# EAGLE schematic citizen_science_flora_v2_DFA_corrected (EAGLE 9.6.2)

## Sheet 1 of 4
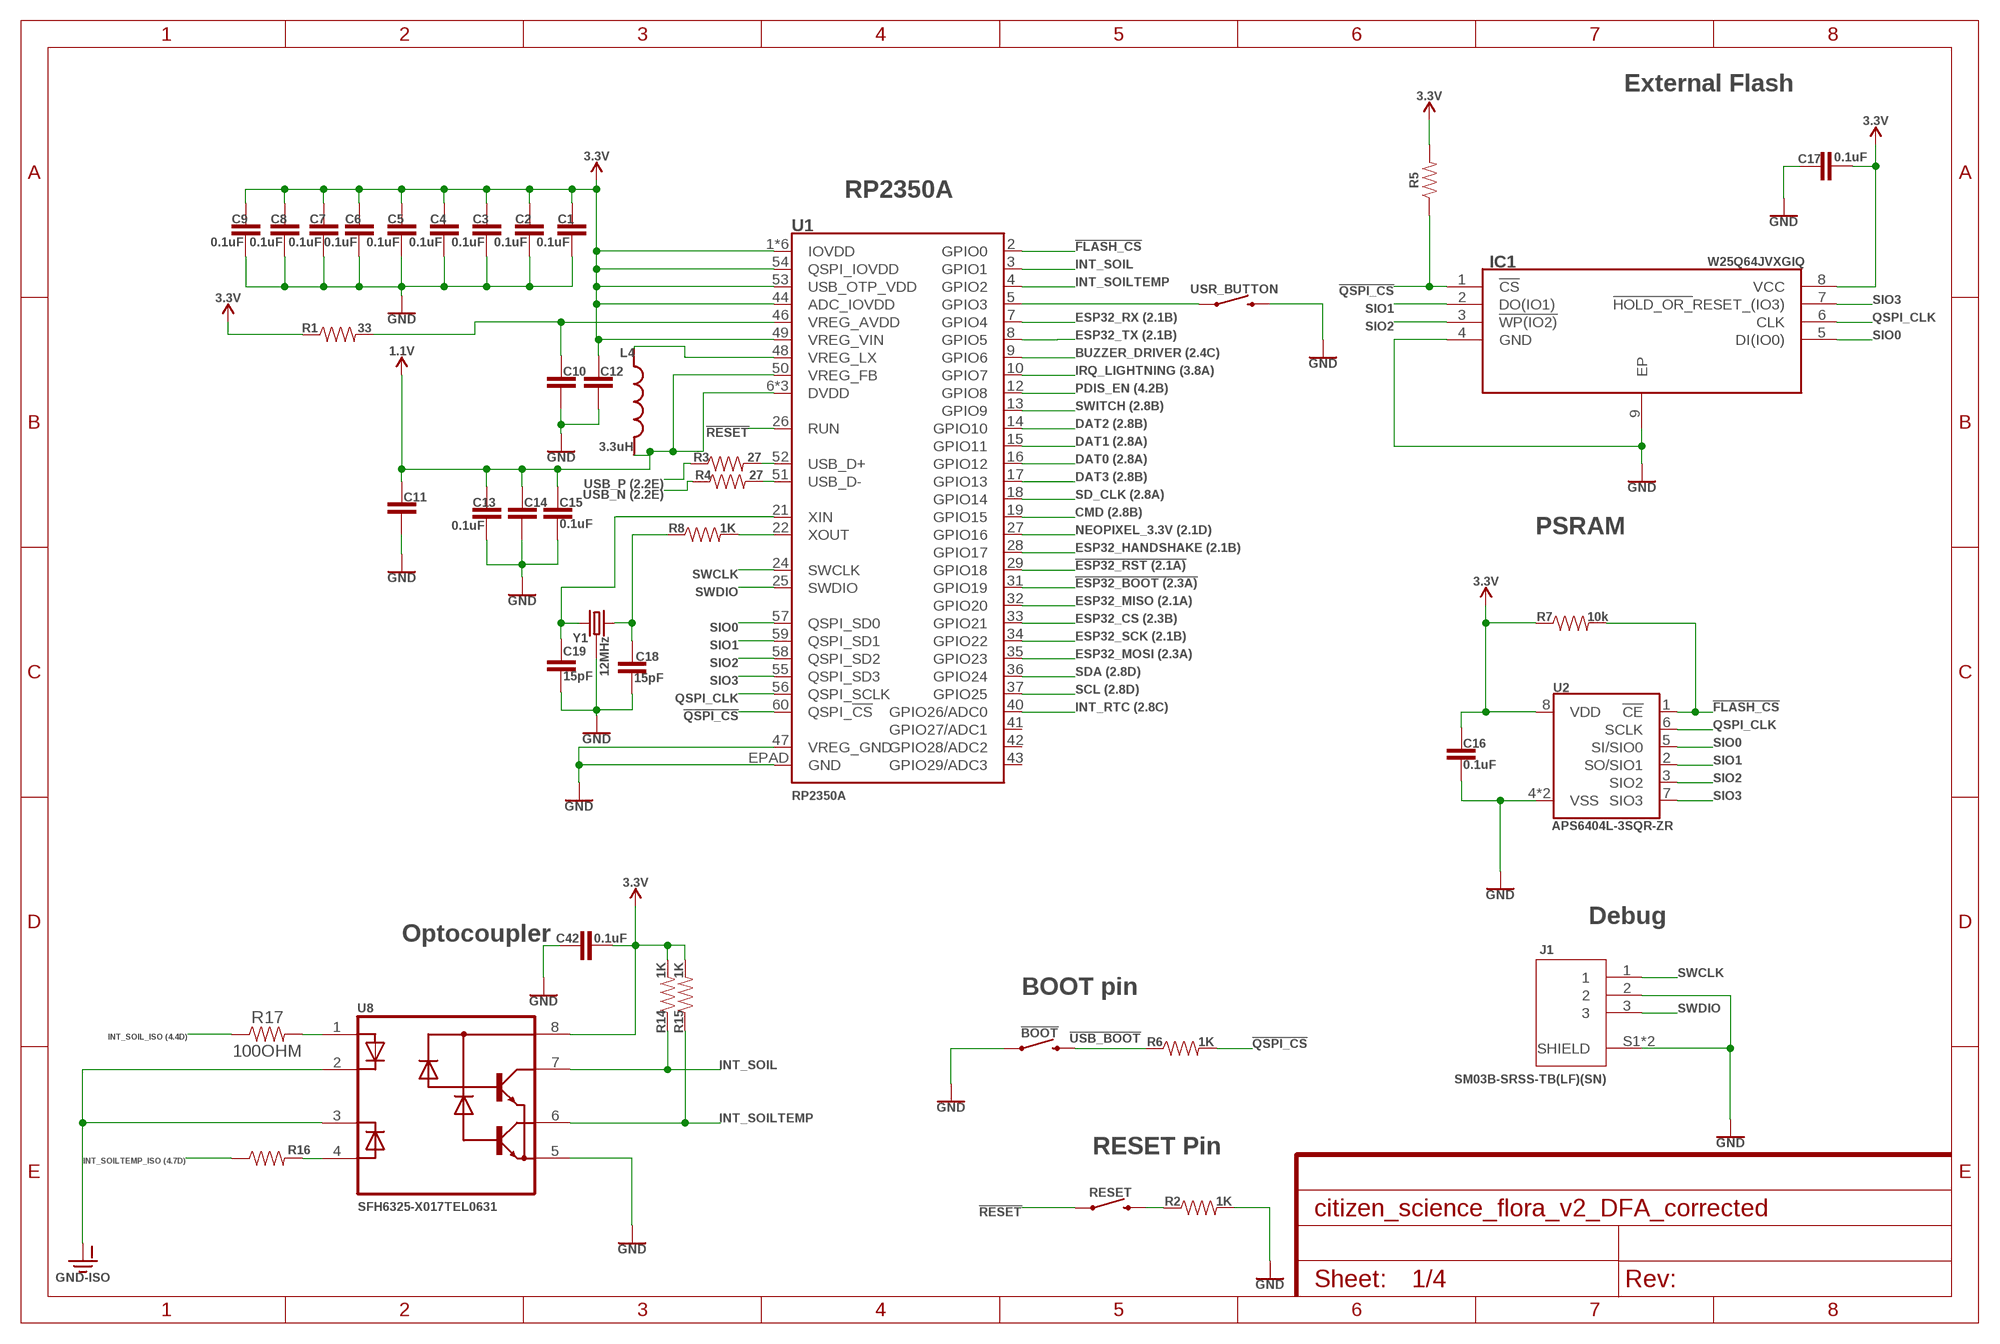
[diagram p0: schematic, sheet 1]

### Parts
!BOOT  MOMENTARY-SWITCH-SPST-SMD-4.6X2.8MM  [TACTILE_SWITCH_SMD_4.6X2.8MM]
C1  0.1uF  0.1UF-0402-6.3V-10%-X7R  [0402]
C2  0.1uF  0.1UF-0402-6.3V-10%-X7R  [0402]
C3  0.1uF  0.1UF-0402-6.3V-10%-X7R  [0402]
C4  0.1uF  0.1UF-0402-6.3V-10%-X7R  [0402]
C5  0.1uF  0.1UF-0402-6.3V-10%-X7R  [0402]
C6  0.1uF  0.1UF-0402-6.3V-10%-X7R  [0402]
C7  0.1uF  0.1UF-0402-6.3V-10%-X7R  [0402]
C8  0.1uF  0.1UF-0402-6.3V-10%-X7R  [0402]
C9  0.1uF  0.1UF-0402-6.3V-10%-X7R  [0402]
C10  4.7UF0402  [0402]
C11  4.7UF0402  [0402]
C12  4.7UF0402  [0402]
C13  0.1uF  0.1UF-0402-6.3V-10%-X7R  [0402]
C14  4.7UF0402  [0402]
C15  0.1uF  0.1UF-0402-6.3V-10%-X7R  [0402]
C16  0.1uF  0.1UF-0402-6.3V-10%-X7R  [0402]
C17  0.1uF  0.1UF-0402-6.3V-10%-X7R  [0402]
C18  15pF  15PF-0402-50V-5%  [0402]
C19  15pF  15PF-0402-50V-5%  [0402]
C42  0.1uF  0.1UF-0402-6.3V-10%-X7R  [0402]
IC1  W25Q64JVXGIQ  [SON80P400X400X50-9N]
J1  SM03B-SRSS-TB(LF)(SN)  [JST_SM03B-SRSS-TB(LF)(SN)]
L4  3.3uH  LQH2MCN120K02L  [IND_LQH2MCN120K02L]
R1  33  33OHM-0402-1/10W-1%  [0402]
R2  1K  1KOHM-0402-1/16W-1%  [0402]
R3  27  27OHM0402  [0402]
R4  27  27OHM0402  [0402]
R5  RESISTOR0402  [0402]
R6  1K  1KOHM-0402-1/16W-1%  [0402]
R7  10k  10KOHM-0402-1/16W-1%  [0402]
R8  1K  1KOHM-0402-1/16W-1%  [0402]
R14  1K  1KOHM-0402-1/16W-1%  [0402]
R15  1K  1KOHM-0402-1/16W-1%  [0402]
R16  100OHM  [0402]
R17  100OHM  [0402]
RESET  MOMENTARY-SWITCH-SPST-SMD-4.6X2.8MM  [TACTILE_SWITCH_SMD_4.6X2.8MM]
U1  RP2350A  [RP2350A]
U2  APS6404L-3SQR-ZR  [APS6404L-3SQR-ZR]
U8  SFH6325-X017TEL0631  [SOIC127P599X175-8N]
USR_BUTTON  MOMENTARY-SWITCH-SPST-SMD-4.6X2.8MM  [TACTILE_SWITCH_SMD_4.6X2.8MM]
Y1  12MHz  CRYSTAL-GROUNDEDSMD-3.2X2.5  [CRYSTAL-SMD-3.2X2.5MM]

### Nets
1.1V: C11.1 C13.1 C14.1 C15.1 L4.2 U1.6(DVDD) U1.23(DVDD) U1.39(DVDD) U1.50(VREG_FB)
3.3V: C1.1 C2.1 C3.1 C4.1 C5.1 C6.1 C7.1 C8.1 C9.1 C12.1 C16.1 C17.2 C42.2 IC1.8(VCC) R1.1 R5.2 R7.1 R14.2 R15.2 U1.1(IOVDD) U1.11(IOVDD) U1.20(IOVDD) U1.30(IOVDD) U1.38(IOVDD) U1.44(ADC_IOVDD) U1.45(IOVDD) U1.49(VREG_VIN) U1.53(USB_OTP_VDD) U1.54(QSPI_IOVDD) U2.8(VDD) U8.8(C(VCC)) ; also sheet 2,3,4
!ESP32_BOOT: U1.31(GPIO19) ; also sheet 2
!ESP32_RST: U1.29(GPIO18) ; also sheet 2
!FLASH_CS: R7.2 U1.2(GPIO0) U2.1(!CE!)
!QSPI_CS: IC1.1(!CS) R5.1 R6.2 U1.60(QSPI_!CS!)
!RESET: RESET.1 RESET.2 U1.26(RUN)
!USB_BOOT: !BOOT.3 !BOOT.4 R6.1
BUZZER_DRIVER: U1.9(GPIO6) ; also sheet 2
CMD: U1.19(GPIO15) ; also sheet 2
DAT0: U1.16(GPIO12) ; also sheet 2
DAT1: U1.15(GPIO11) ; also sheet 2
DAT2: U1.14(GPIO10) ; also sheet 2
DAT3: U1.17(GPIO13) ; also sheet 2
ESP32_CS: U1.33(GPIO21) ; also sheet 2
ESP32_HANDSHAKE: U1.28(GPIO17) ; also sheet 2
ESP32_MISO: U1.32(GPIO20) ; also sheet 2
ESP32_MOSI: U1.35(GPIO23) ; also sheet 2
ESP32_RX: U1.7(GPIO4) ; also sheet 2
ESP32_SCK: U1.34(GPIO22) ; also sheet 2
ESP32_TX: U1.8(GPIO5) ; also sheet 2
GND: !BOOT.1 !BOOT.2 C1.2 C2.2 C3.2 C4.2 C5.2 C6.2 C7.2 C8.2 C9.2 C10.2 C11.2 C12.2 C13.2 C14.2 C15.2 C16.2 C17.1 C18.2 C19.2 C42.1 IC1.4(GND) IC1.9(EP) J1.2 J1.S1(SHIELD) J1.S2(SHIELD) R2.2 U1.47(VREG_GND) U1.EPAD(GND) U2.4(VSS) U2.9(VSS) U8.5(E(GND)) USR_BUTTON.3 USR_BUTTON.4 Y1.2(GND) Y1.4(GND) ; also sheet 2,3,4
GND-ISO: U8.2(C1) U8.3(C2) ; also sheet 4
INT_RTC: U1.40(GPIO26/ADC0) ; also sheet 2
INT_SOIL: R14.1 U1.3(GPIO1) U8.7(C1(VO1))
INT_SOIL_ISO: R17.1 ; also sheet 4
INT_SOILTEMP: R15.1 U1.4(GPIO2) U8.6(C2(VO2))
INT_SOILTEMP_ISO: R16.1 ; also sheet 4
IRQ_LIGHTNING: U1.10(GPIO7) ; also sheet 3
N$1: C10.1 R1.2 U1.46(VREG_AVDD)
N$2: L4.1 U1.48(VREG_LX)
N$3: R2.1 RESET.3 RESET.4
N$4: C18.1 R8.1 Y1.3
N$7: C19.1 U1.21(XIN) Y1.1
N$8: R8.2 U1.22(XOUT)
N$13: R16.2 U8.4(A2)
N$14: R17.2 U8.1(A1)
N$25: U1.5(GPIO3) USR_BUTTON.1 USR_BUTTON.2
NEOPIXEL_3.3V: U1.27(GPIO16) ; also sheet 2
PDIS_EN: U1.12(GPIO8) ; also sheet 4
QSPI_CLK: IC1.6(CLK) U1.56(QSPI_SCLK) U2.6(SCLK)
SCL: U1.37(GPIO25) ; also sheet 2,3,4
SD_CLK: U1.18(GPIO14) ; also sheet 2
SDA: U1.36(GPIO24) ; also sheet 2,3,4
SIO0: IC1.5(DI(IO0)) U1.57(QSPI_SD0) U2.5(SI/SIO0)
SIO1: IC1.2(DO(IO1)) U1.59(QSPI_SD1) U2.2(SO/SIO1)
SIO2: IC1.3(!WP(IO2)) U1.58(QSPI_SD2) U2.3(SIO2)
SIO3: IC1.7(!HOLD_OR_!RESET_(IO3)) U1.55(QSPI_SD3) U2.7(SIO3)
SWCLK: J1.1 U1.24(SWCLK)
SWDIO: J1.3 U1.25(SWDIO)
SWITCH: U1.13(GPIO9) ; also sheet 2
USB_N: R4.1 ; also sheet 2
USB_P: R3.1 ; also sheet 2
USBD_N: R4.2 U1.51(USB_D-)
USBD_P: R3.2 U1.52(USB_D+)
Unconnected: U1.41(GPIO27/ADC1) U1.42(GPIO28/ADC2) U1.43(GPIO29/ADC3)

### Notes on the sheet
- External Flash
- RP2350A
- PSRAM
- Debug
- Optocoupler
- BOOT pin
- RESET Pin

## Sheet 2 of 4
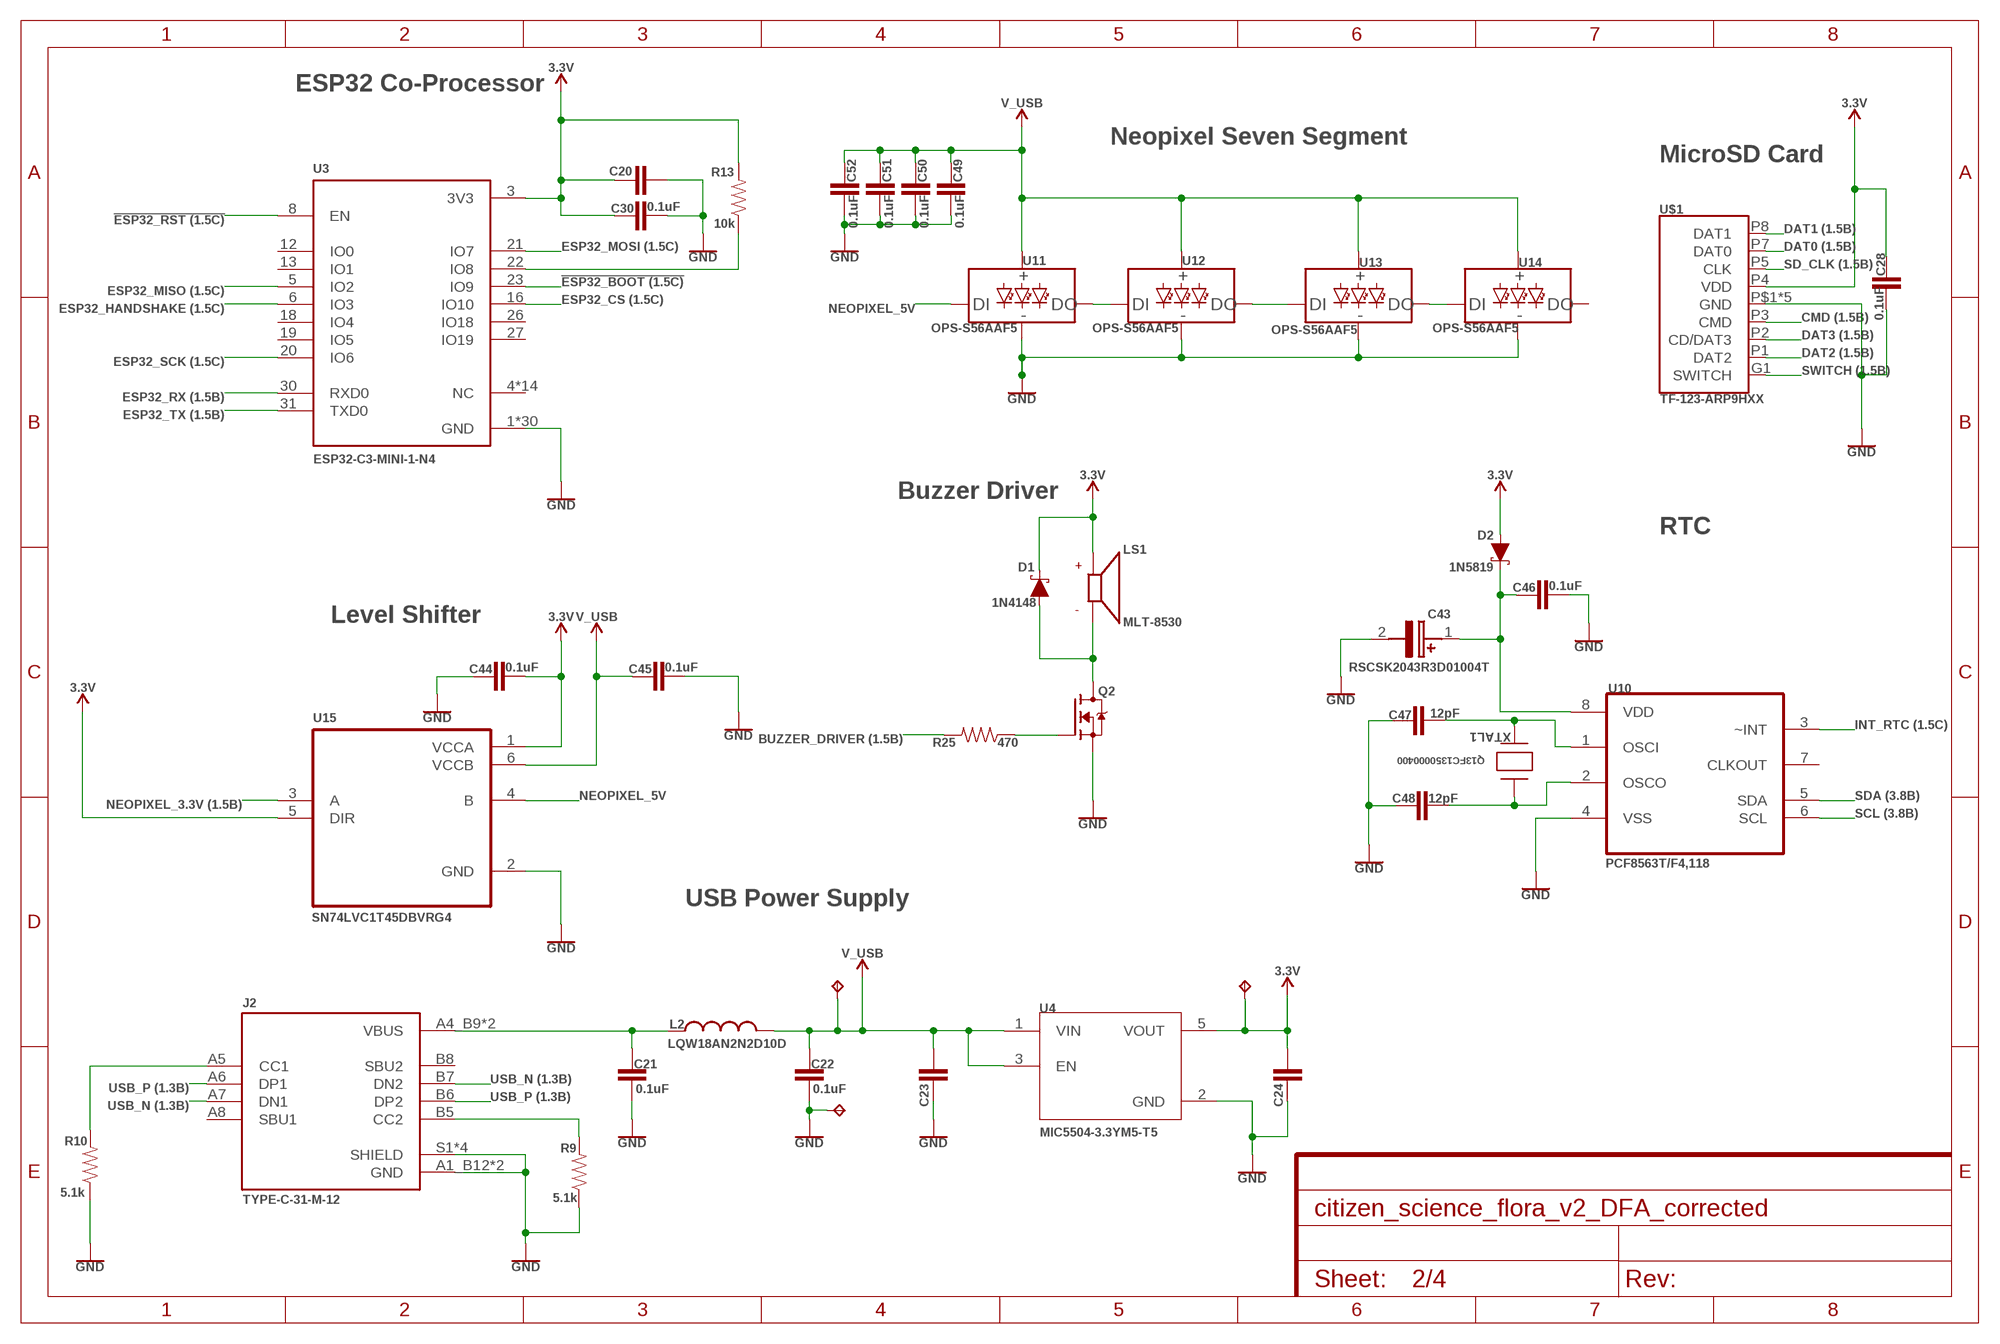
[diagram p1: schematic, sheet 2]

### Parts
3.3V  TPB1,27  [B1,27]
C20  10UF0402  [0402]
C21  0.1uF  0.1UF-0402-6.3V-10%-X7R  [0402]
C22  0.1uF  0.1UF-0402-6.3V-10%-X7R  [0402]
C23  10UF0402  [0402]
C24  10UF0402  [0402]
C28  0.1uF  0.1UF-0402-6.3V-10%-X7R  [0402]
C30  0.1uF  0.1UF-0402-6.3V-10%-X7R  [0402]
C43  RSCSK2043R3D01004T  [RSCSK2043R3D01004T]
C44  0.1uF  0.1UF-0402-6.3V-10%-X7R  [0402]
C45  0.1uF  0.1UF-0402-6.3V-10%-X7R  [0402]
C46  0.1uF  0.1UF-0402-6.3V-10%-X7R  [0402]
C47  12pF  12PF-0402-50V-5%  [0402]
C48  12pF  12PF-0402-50V-5%  [0402]
C49  0.1uF  0.1UF-0402-6.3V-10%-X7R  [0402]
C50  0.1uF  0.1UF-0402-6.3V-10%-X7R  [0402]
C51  0.1uF  0.1UF-0402-6.3V-10%-X7R  [0402]
C52  0.1uF  0.1UF-0402-6.3V-10%-X7R  [0402]
D1  1N4148  DIODE-SCHOTTKY-BAT60A  [SOD-323]
D2  1N5819  DIODE-SCHOTTKY-BAT20J  [SOD-323]
GND  TPB1,27  [B1,27]
J2  TYPE-C-31-M-12  [HRO_TYPE-C-31-M-12]
L2  LQW18AN2N2D10D  [INDC1608X100N]
LS1  MLT-8530  CMT-8504-100-SMT-TR  [XDCR_CMT-8504-100-SMT-TR]
Q2  BSS138  [SOT95P240X111-3N]
R9  5.1k  5.1KOHM-0402-1/16W-1%  [0402]
R10  5.1k  5.1KOHM-0402-1/16W-1%  [0402]
R13  10k  10KOHM-0402-1/16W-1%  [0402]
R25  470  10KOHM-0402-1/16W-1%  [0402]
U3  ESP32-C3-MINI-1-N4  [XCVR_ESP32-C3-MINI-1-N4]
U4  MIC5504-3.3YM5-T5  [SOT95P280X145-5N]
U10  PCF8563T/F4,118  [SOIC127P600X175-8N]
U11  OPS-S56AAF5  [OPS-S56AAF5]
U12  OPS-S56AAF5  [OPS-S56AAF5]
U13  OPS-S56AAF5  [OPS-S56AAF5]
U14  OPS-S56AAF5  [OPS-S56AAF5]
U15  SN74LVC1T45DBVRG4  [SOT95P280X145-6N]
U$1  TF-123-ARP9HXX  [MICROSDCARD]
USB  V_USB  TPB1,27  [B1,27]
XTAL1  Q13FC1350000400  [XTAL_FC-135_EPS]

### Nets
3.3V: 3.3V.TP C20.1 C24.2 C28.1 C30.1 C44.2 D1.C D2.A LS1.P R13.2 U3.3(3V3) U4.5(VOUT) U15.1(VCCA) U15.5(DIR) U$1.P4(VDD) ; also sheet 1,3,4
!ESP32_BOOT: U3.23(IO9) ; also sheet 1
!ESP32_RST: U3.8(EN) ; also sheet 1
BUZZER_DRIVER: R25.2 ; also sheet 1
CMD: U$1.P3(CMD) ; also sheet 1
DAT0: U$1.P7(DAT0) ; also sheet 1
DAT1: U$1.P8(DAT1) ; also sheet 1
DAT2: U$1.P1(DAT2) ; also sheet 1
DAT3: U$1.P2(CD/DAT3) ; also sheet 1
ESP32_CS: U3.16(IO10) ; also sheet 1
ESP32_HANDSHAKE: U3.6(IO3) ; also sheet 1
ESP32_MISO: U3.5(IO2) ; also sheet 1
ESP32_MOSI: U3.21(IO7) ; also sheet 1
ESP32_RX: U3.30(RXD0) ; also sheet 1
ESP32_SCK: U3.20(IO6) ; also sheet 1
ESP32_TX: U3.31(TXD0) ; also sheet 1
GND: C20.2 C21.2 C22.2 C23.1 C24.1 C28.2 C30.2 C43.2(-) C44.1 C45.2 C46.2 C47.1 C48.1 C49.2 C50.2 C51.2 C52.2 GND.TP J2.A1_B12(GND) J2.B1_A12(GND) J2.S1(SHIELD) J2.S2(SHIELD) J2.S3(SHIELD) J2.S4(SHIELD) Q2.2(S) R9.1 R10.1 U3.1(GND) U3.2(GND) U3.11(GND) U3.14(GND) U3.36(GND) U3.37(GND) U3.38(GND) U3.39(GND) U3.40(GND) U3.41(GND) U3.42(GND) U3.43(GND) U3.44(GND) U3.45(GND) U3.46(GND) U3.47(GND) U3.48(GND) U3.49_1(GND) U3.49_2(GND) U3.49_3(GND) U3.49_4(GND) U3.49_5(GND) U3.49_6(GND) U3.49_7(GND) U3.49_8(GND) U3.49_9(GND) U3.50(GND) U3.51(GND) U3.52(GND) U3.53(GND) U4.2(GND) U10.4(VSS) U11.P$3(GND) U12.P$3(GND) U13.P$3(GND) U14.P$3(GND) U15.2(GND) U$1.P6(GND) U$1.P$1(GND) U$1.P$2(GND) U$1.P$3(GND) U$1.P$4(GND) ; also sheet 1,3,4
INT_RTC: U10.3(~INT) ; also sheet 1
N$9: J2.A5(CC1) R10.2
N$10: J2.B5(CC2) R9.2
N$11: C21.1 J2.A4_B9(VBUS) J2.B4_A9(VBUS) L2.1
N$12: R13.1 U3.22(IO8)
N$22: U11.P$2(DO) U12.P$4(DI)
N$23: U12.P$2(DO) U13.P$4(DI)
N$24: U13.P$2(DO) U14.P$4(DI)
N$26: D1.A LS1.N Q2.3(D)
N$27: Q2.1(G) R25.1
N$28: C43.1(+) C46.1 D2.C U10.8(VDD)
N$29: C48.2 U10.2(OSCO) XTAL1.1
N$30: C47.2 U10.1(OSCI) XTAL1.2
NEOPIXEL_3.3V: U15.3(A) ; also sheet 1
NEOPIXEL_5V: U11.P$4(DI) U15.4(B)
SCL: U10.6(SCL) ; also sheet 1,3,4
SD_CLK: U$1.P5(CLK) ; also sheet 1
SDA: U10.5(SDA) ; also sheet 1,3,4
SWITCH: U$1.G1(SWITCH) ; also sheet 1
USB_N: J2.A7(DN1) J2.B7(DN2) ; also sheet 1
USB_P: J2.A6(DP1) J2.B6(DP2) ; also sheet 1
V_USB: C22.1 C23.2 C45.1 C49.1 C50.1 C51.1 C52.1 L2.2 U4.1(VIN) U4.3(EN) U11.P$1(VCC) U12.P$1(VCC) U13.P$1(VCC) U14.P$1(VCC) U15.6(VCCB) USB.TP ; also sheet 4
Unconnected: J2.A8(SBU1) J2.B8(SBU2) U3.4(NC) U3.7(NC) U3.9(NC) U3.10(NC) U3.12(IO0) U3.13(IO1) U3.15(NC) U3.17(NC) U3.18(IO4) U3.19(IO5) U3.24(NC) U3.25(NC) U3.26(IO18) U3.27(IO19) U3.28(NC) U3.29(NC) U3.32(NC) U3.33(NC) U3.34(NC) U3.35(NC) U10.7(CLKOUT) U14.P$2(DO)

### Notes on the sheet
- ESP32 Co-Processor
- Neopixel Seven Segment
- MicroSD Card
- Buzzer Driver
- RTC
- Level Shifter
- USB Power Supply

## Sheet 3 of 4
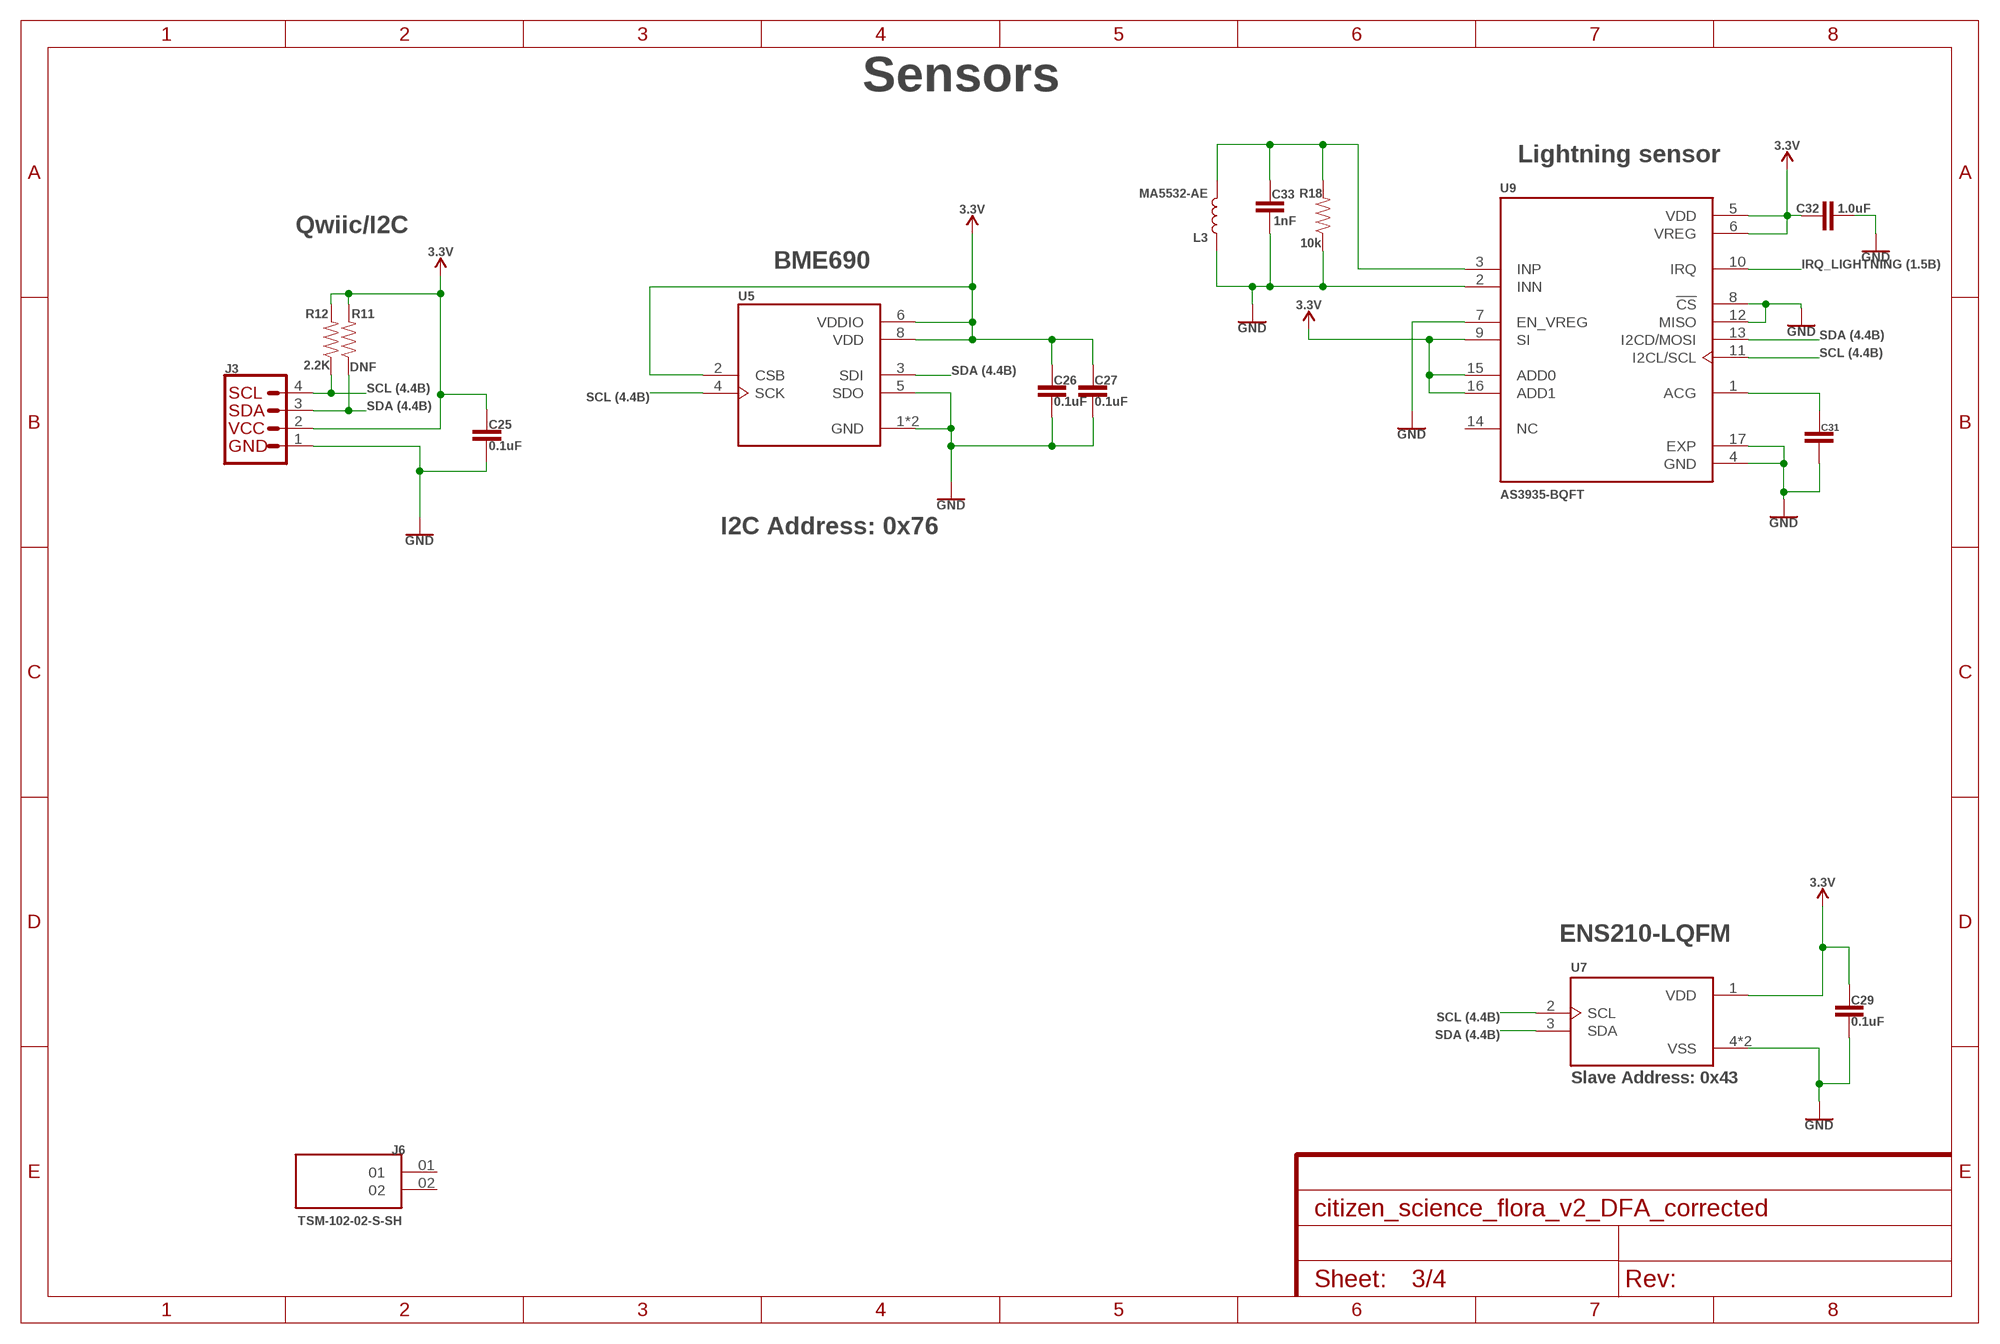
[diagram p2: schematic, sheet 3]

### Parts
C25  0.1uF  0.1UF-0402-6.3V-10%-X7R  [0402]
C26  0.1uF  0.1UF-0402-6.3V-10%-X7R  [0402]
C27  0.1uF  0.1UF-0402-6.3V-10%-X7R  [0402]
C29  0.1uF  0.1UF-0402-6.3V-10%-X7R  [0402]
C31  10UF0402  [0402]
C32  1.0uF  1.0UF-0402-16V-10%  [0402]
C33  1nF  1.0NF/1000PF-0402-25V-10%-X7R  [0402]
J3  QWIIC_CONNECTORJS-1MM  [1X04_1MM_RA]
J6  TSM-102-02-S-SH  [SAMTEC_TSM-102-02-S-SH]
L3  MA5532-AE  [MA5532-AE]
R11  DNF  2.2KOHM-0402-1/16W-1%  [0402]
R12  2.2K  2.2KOHM-0402-1/16W-1%  [0402]
R18  10k  10KOHM-0402-1/16W-1%  [0402]
U5  BME690  [IC_BME688]
U7  ENS210-LQFM  [XDCR_ENS210-LQFM]
U9  AS3935-BQFT  [QFN65P400X400X80-17N]

### Nets
3.3V: C25.1 C26.1 C27.1 C29.1 C32.1 J3.2 R11.2 R12.2 U5.2(CSB) U5.6(VDDIO) U5.8(VDD) U7.1(VDD) U9.5(VDD) U9.6(VREG) U9.9(SI) U9.15(ADD0) U9.16(ADD1) ; also sheet 1,2,4
GND: C25.2 C26.2 C27.2 C29.2 C31.2 C32.2 C33.2 J3.1 L3.1 R18.1 U5.1(GND) U5.5(SDO) U5.7(GND) U7.4(VSS) U7.5(VSS) U9.2(INN) U9.4(GND) U9.7(EN_VREG) U9.8(!CS) U9.12(MISO) U9.17(EXP) ; also sheet 1,2,4
IRQ_LIGHTNING: U9.10(IRQ) ; also sheet 1
N$15: C31.1 U9.1(ACG)
N$16: C33.1 L3.2 R18.2 U9.3(INP)
SCL: J3.4 R12.1 U5.4(SCK) U7.2(SCL) U9.11(I2CL/SCL) ; also sheet 1,2,4
SDA: J3.3 R11.1 U5.3(SDI) U7.3(SDA) U9.13(I2CD/MOSI) ; also sheet 1,2,4
Unconnected: J6.01 J6.02 U9.14(NC)

### Notes on the sheet
- Sensors
- Lightning sensor
- Qwiic/I2C
- I2C Address: 0x76
- Slave Address: 0x43

## Sheet 4 of 4
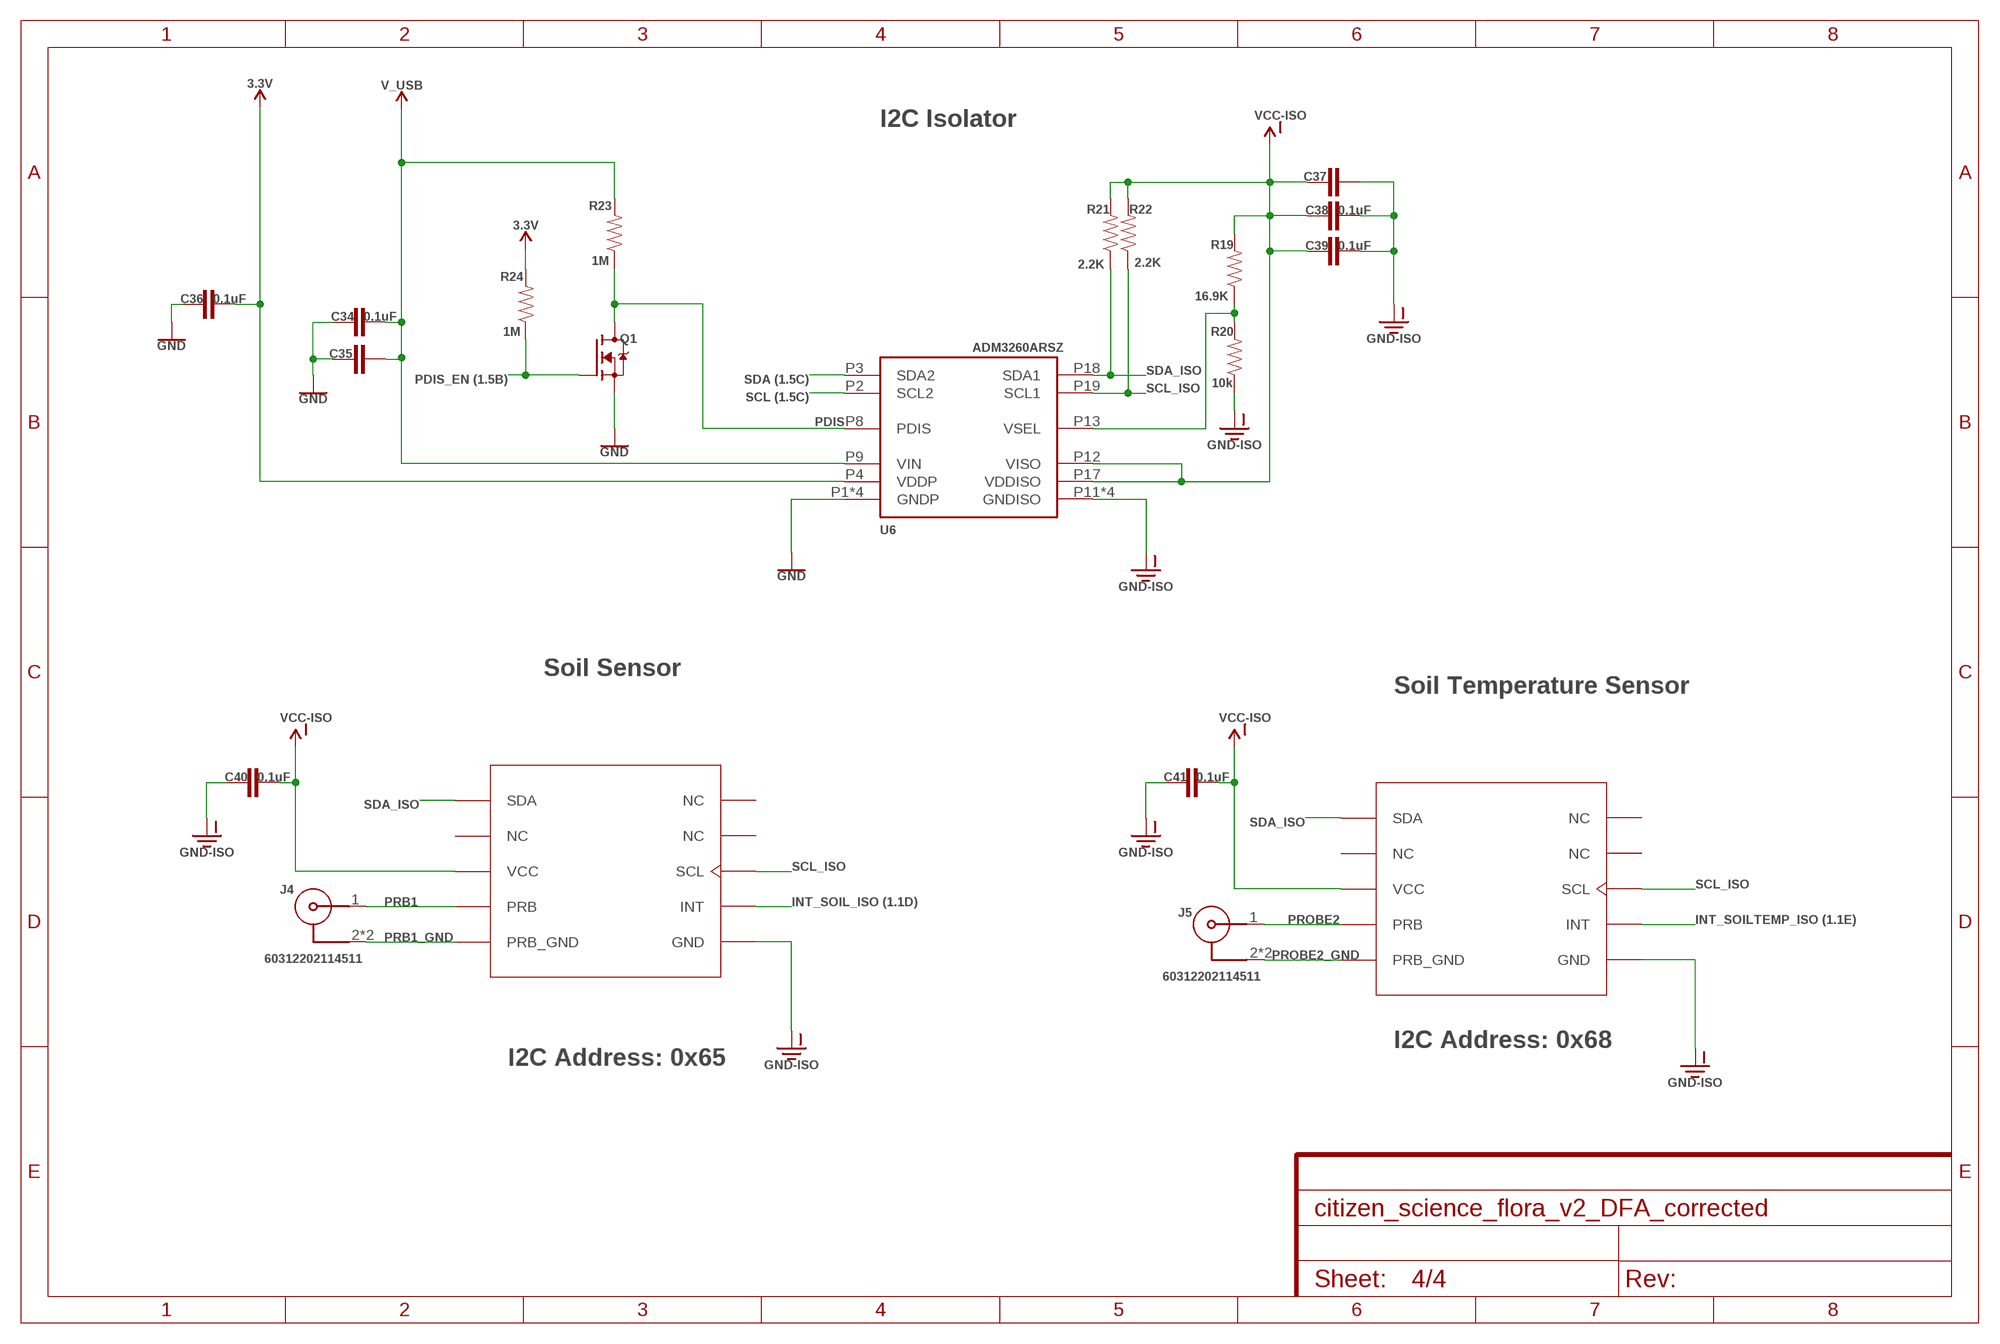
[diagram p3: schematic, sheet 4]

### Parts
C34  0.1uF  0.1UF-0402-6.3V-10%-X7R  [0402]
C35  10UF0402  [0402]
C36  0.1uF  0.1UF-0402-6.3V-10%-X7R  [0402]
C37  10UF0402  [0402]
C38  0.1uF  0.1UF-0402-6.3V-10%-X7R  [0402]
C39  0.1uF  0.1UF-0402-6.3V-10%-X7R  [0402]
C40  0.1uF  0.1UF-0402-6.3V-10%-X7R  [0402]
C41  0.1uF  0.1UF-0402-6.3V-10%-X7R  [0402]
J4  60312202114511  [60312202114511]
J5  60312202114511  [60312202114511]
Q1  BSS138  [SOT95P240X111-3N]
R19  16.9K  RESISTOR0402  [0402]
R20  10k  10KOHM-0402-1/16W-1%  [0402]
R21  2.2K  2.2KOHM-0402-1/16W-1%  [0402]
R22  2.2K  2.2KOHM-0402-1/16W-1%  [0402]
R23  1M  1MOHM-0402-1/16W-5%  [0402]
R24  1M  1MOHM-0402-1/16W-5%  [0402]
U6  ADM3260ARSZ  [SSOP20]
U$2  PH-OEM  [PH_SENSOR]
U$3  PH-OEM  [PH_SENSOR]

### Nets
3.3V: C36.2 R24.2 U6.P4(VDDP) ; also sheet 1,2,3
GND: C34.1 C35.1 C36.1 Q1.2(S) U6.P1(GNDP) U6.P5(GNDP) U6.P7(GNDP) U6.P10(GNDP) ; also sheet 1,2,3
GND-ISO: C37.2 C38.2 C39.2 C40.1 C41.1 R20.1 U6.P11(GNDISO) U6.P14(GNDISO) U6.P16(GNDISO) U6.P20(GNDISO) U$2.P$6(GND) U$3.P$6(GND) ; also sheet 1
INT_SOIL_ISO: U$2.P$7(INT) ; also sheet 1
INT_SOILTEMP_ISO: U$3.P$7(INT) ; also sheet 1
N$17: R19.1 R20.2 U6.P13(VSEL)
PDIS: Q1.3(D) R23.1 U6.P8(PDIS)
PDIS_EN: Q1.1(G) R24.1 ; also sheet 1
PRB1: J4.1 U$2.P$4(PRB)
PRB1_GND: J4.2 J4.3 U$2.P$5(PRB_GND)
PROBE2: J5.1 U$3.P$4(PRB)
PROBE2_GND: J5.2 J5.3 U$3.P$5(PRB_GND)
SCL: U6.P2(SCL2) ; also sheet 1,2,3
SCL_ISO: R22.1 U6.P19(SCL1) U$2.P$8(SCL) U$3.P$8(SCL)
SDA: U6.P3(SDA2) ; also sheet 1,2,3
SDA_ISO: R21.1 U6.P18(SDA1) U$2.P$1(SDA) U$3.P$1(SDA)
V_USB: C34.2 C35.2 R23.2 U6.P9(VIN) ; also sheet 2
VCC-ISO: C37.1 C38.1 C39.1 C40.2 C41.2 R19.2 R21.2 R22.2 U6.P12(VISO) U6.P17(VDDISO) U$2.P$3(VCC) U$3.P$3(VCC)
Unconnected: U$2.P$2(NC) U$2.P$9(NC) U$2.P$10(NC) U$3.P$2(NC) U$3.P$9(NC) U$3.P$10(NC)

### Notes on the sheet
- I2C Isolator
- Soil Sensor
- Soil Temperature Sensor
- I2C Address: 0x68
- I2C Address: 0x65

## Library data of the parts
3.3V GND USB = testpad:TP: Test pad
!BOOT RESET USR_BUTTON = SparkFun-Switches:MOMENTARY-SWITCH-SPST: Momentary Switch (Pushbutton) - SPST Normally-open (NO) SPST momentary switches (buttons, pushbuttons). Variants PTH-12MM - 12mm square, through-hole Momentary Pushbutton Switch - 12mm Square (COM-09190) PTH-6.0MM, PTH-6.0MM-KIT - 6.0mm square, through-hole Mini Pushbutton Switch (COM-00097) KIT package intended for soldering kit's - only one side of pads' copper is exposed. PTH-RIGHT-ANGLE-KIT - Right-angle, through-hole Right Angle Tactile Button - Used on SparkFun BigTime Watch Kit SMD-12MM - 12mm square, surface-mount Tactile Button - SMD (12mm) (COM-12993) Used on SparkFun PicoBoard SMD-4.5MM - 4.5mm Square Trackball Switch Used on SparkFun Blackberry Trackballer Breakout SMD-4.6MMX2.8MM - 4.60mm x 2.80mm, surface mount Used on SparkFun Pro Micro - RP2040 SMD-5.2MM, SMD-5.2-REDUNDANT - 5.2mm square, surface-mount Mini Pushbutton Switch - SMD (COM-08720) Used on Arduino Pro Mini REDUNDANT package connects both switch circuits together SMD-6.0X3.5MM - 6.0 x 3.5mm, surface mount Momentary Reset Switch SMD (COM-08229) SMD-6.2MM-TALL - 6.2mm square, surface mount Tactile Button - SMD (6mm) Used on SparkFun Digital Sandbox SMD-RIGHT-ANGLE - Right-angle, surface mount Used on SparkFun Block for Intel® Edison - Arduino; PROD_ID: SWCH-15606
C1-C9 C13 C15-C17 C21 C22 C25-C30 C34 C36 C38-C42 C44-C46 C49-C52 = SparkFun-Capacitors:0.1UF: 0.1µF ceramic capacitors A capacitor is a passive two-terminal electrical component used to store electrical energy temporarily in an electric field.; PROD_ID: CAP-14993
C10-C12 C14 = SparkFun-Capacitors_Sai:4.7UF: 4.7µF ceramic capacitors A capacitor is a passive two-terminal electrical component used to store electrical energy temporarily in an electric field.
C18 C19 = SparkFun-Capacitors:15PF: 15pF ceramic capacitors A capacitor is a passive two-terminal electrical component used to store electrical energy temporarily in an electric field.; PROD_ID: CAP-13063
C20 C23 C24 C31 C35 C37 = SparkFun-Capacitors_Sai:10UF: 10.0µF ceramic capacitors A capacitor is a passive two-terminal electrical component used to store electrical energy temporarily in an electric field.
C32 = SparkFun-Capacitors:1.0UF: 1µF ceramic capacitors A capacitor is a passive two-terminal electrical component used to store electrical energy temporarily in an electric field.; PROD_ID: CAP-12417
C33 = SparkFun-Capacitors:1.0NF/1000PF: 1nF/1,000pF ceramic capacitors A capacitor is a passive two-terminal electrical component used to store electrical energy temporarily in an electric field.; PROD_ID: CAP-15061
C43 = SamacSys_Parts:RSCSK2043R3D01004T: Supercapacitors / Ultracapacitors 0.2F 3.3V -20+80 Source: Datasheet; DESCRIPTION: Supercapacitors / Ultracapacitors 0.2F 3.3V -20+80; HEIGHT: 1.8mm; MANUFACTURER_NAME: Elna; MANUFACTURER_PART_NUMBER: RSCSK2043R3D01004T; MOUSER_PART_NUMBER: 555-DSK3R3H204T614H2; MOUSER_PRICE-STOCK: https://www.mouser.co.uk/ProductDetail/Elna/RSCSK2043R3D01004T?qs=4ASt3YYao0W6joWWDTvrLg%3D%3D
C47 C48 = SparkFun-Capacitors:12PF: 12pF ceramic capacitors A capacitor is a passive two-terminal electrical component used to store electrical energy temporarily in an electric field.; PROD_ID: CAP-14665
D1 = SparkFun-DiscreteSemi:DIODE-SCHOTTKY: Schottky diode A Schottky diode is a semiconductor diode which has a low forward voltage drop and a very fast switching action.; PROD_ID: DIO-14072; VALUE: 3A/10V/280mV
D2 = SparkFun-DiscreteSemi:DIODE-SCHOTTKY: Schottky diode A Schottky diode is a semiconductor diode which has a low forward voltage drop and a very fast switching action.; PROD_ID: DIO-11623; VALUE: 1A/23V/620mV
IC1 = SamacSys_Parts:W25Q64JVXGIQ: 64M-bit Serial Flash Memory with uniform 4KB sectors and Dual/Quad SPI Source: Datasheet; DESCRIPTION: 64M-bit Serial Flash Memory with uniform 4KB sectors and Dual/Quad SPI; HEIGHT: 0.5mm; MANUFACTURER_NAME: Winbond; MANUFACTURER_PART_NUMBER: W25Q64JVXGIQ
J1 = SM03B-SRSS-TB_LF__SN_:SM03B-SRSS-TB(LF)(SN): SH Series 3 Position 1 mm Pitch Surface Mount Side Entry Shrouded Header Check availability; AVAILABILITY: In Stock; CHECK_PRICES: https://www.snapeda.com/parts/SM03B-SRSS-TB(LF)(SN)/JST+Sales+America+Inc./view-part/?ref=eda; DESCRIPTION: Connector Header Surface Mount, Right Angle 3 position 0.039 (1.00mm); MF: JST Sales America Inc.; MP: SM03B-SRSS-TB(LF)(SN); PACKAGE: None; PRICE: None; SNAPEDA_LINK: https://www.snapeda.com/parts/SM03B-SRSS-TB(LF)(SN)/JST+Sales+America+Inc./view-part/?ref=snap
J2 = TYPE-C-31-M-12:TYPE-C-31-M-12: Check availability; AVAILABILITY: Not in stock; CHECK_PRICES: https://www.snapeda.com/parts/TYPE-C-31-M-12/HRO+Electronics+Co.%252C+Ltd./view-part/?ref=eda; DESCRIPTION: USB Connectors 24 Receptacle 1 8.94*7.3mm RoHS; MF: HRO Electronics Co., Ltd.; MP: TYPE-C-31-M-12; PACKAGE: Package; PRICE: None; SNAPEDA_LINK: https://www.snapeda.com/parts/TYPE-C-31-M-12/HRO+Electronics+Co.%252C+Ltd./view-part/?ref=snap
J3 = SparkFun-Connectors:QWIIC_CONNECTOR: SparkFun I2C Standard Qwiic Connector An SMD 1mm pitch JST connector makes it easy and quick (get it? Qwiic?) to connect I2C devices to each other. The Qwiic system <http://www.sparkfun.com/qwiic> enables fast and solderless connection between popular platforms and various sensors and actuators. We carry 200mm <https://www.sparkfun.com/products/14204>, 100mm <https://www.sparkfun.com/products/14205>, 50mm <https://www.sparkfun.com/products/14206>, and breadboard friendly <https://www.sparkfun.com/products/14207> Qwiic cables. We also offer 10 pcs strips <https://www.sparkfun.com/products/14323> the SMD connectors.; PROD_ID: CONN-13694
J4 J5 = 60312202114511:60312202114511: WR-SMA PCB End Launch Characteristics Interface: MIL-STD-348 Mating Cycle: 500 Cycles Impedance: 50Ω Insulation Resistance: 5000MΩ(min.) Withstanding Voltage: 1000Vrms(min.) Ingress Protection: None l IP67 Mating: Screw (Recommended by torque wrench tool) Applications Network and communications RF Test and measurement equipment Industrial applications Electronic consumers and device Outdoor or humid environment Details see: www.we-online.com/components/products/COAX_SMA_CONNECTOR_PCB_END_LAUNCH Updated by Ella Wu 2023-10-10 2023(C) Würth Elektronik Check availability; AVAILABILITY: In Stock; CHECK_PRICES: https://www.snapeda.com/parts/60312202114511/Wurth+Electronics+Inc./view-part/?ref=eda; DESCRIPTION: SMA Connector Jack, Female Socket 50Ohm Board Edge, End Launch; Through Hole, Right Angle Solder; MF: Wurth Electronics; MP: 60312202114511; PACKAGE: None; PRICE: None; PURCHASE-URL: https://www.snapeda.com/api/url_track_click_mouser/?unipart_id=3995265&manufacturer=Wurth Electronics&part_name=60312202114511&search_term=60312202114511; SNAPEDA_LINK: https://www.snapeda.com/parts/60312202114511/Wurth+Electronics+Inc./view-part/?ref=snap
J6 = TSM-102-02-S-SH:TSM-102-02-S-SH: Check availability; AVAILABILITY: In Stock; DESCRIPTION: TSM - Samtec 2.54mm Single Row Horizontal Surface Mount Header 8.13mm Post Height (02) - Fast Stock; MF: Samtec; MP: TSM-102-02-S-SH; PACKAGE: None; PRICE: None; PURCHASE-URL: https://pricing.snapeda.com/search/part/TSM-102-02-S-SH/?ref=eda
L2 = LQW18AN2N2D10D:LQW18AN2N2D10D: Inductor RF Chip Unshielded Wirewound 2.2nH 0.5nH 100MHz 25Q-Factor Ceramic 1.4A 18mOhm DCR 0603 T/R Check availability; AVAILABILITY: In Stock; CHECK_PRICES: https://www.snapeda.com/parts/LQW18AN2N2D10D/Murata/view-part/?ref=eda; DESCRIPTION: Inductor with Inductance: 2.2nH Tol. +/-0.5nH, Package: 0603 (1608); MF: Murata; MP: LQW18AN2N2D10D; PACKAGE: 1608 Murata; PRICE: None; PURCHASE-URL: https://www.snapeda.com/api/url_track_click_mouser/?unipart_id=1503005&manufacturer=Murata&part_name=LQW18AN2N2D10D&search_term=2.2nh 0603; SNAPEDA_LINK: https://www.snapeda.com/parts/LQW18AN2N2D10D/Murata/view-part/?ref=snap
L3 = MA5532-AE:MA5532-AE: RFID Transponder Coil - MA5532-AE Check availability; AVAILABILITY: Not in stock; CHECK_PRICES: https://www.snapeda.com/parts/MA5532-AE/Coilcraft/view-part/?ref=eda; DESCRIPTION: RFID transponder coil, SMT, RoHS; MF: Coilcraft; MP: MA5532-AE; PACKAGE: None; PRICE: None; SNAPEDA_LINK: https://www.snapeda.com/parts/MA5532-AE/Coilcraft/view-part/?ref=snap
L4 = LQH2MCN120K02L:LQH2MCN120K02L: Check availability; AVAILABILITY: In Stock; CHECK_PRICES: https://www.snapeda.com/parts/LQH2MCN120K02L/Murata/view-part/?ref=eda; DESCRIPTION: Inductor with Inductance: 12uH Tol. +/-10%, Package: 0806 (2016); MF: Murata; MP: LQH2MCN120K02L; PACKAGE: NONSTANDARD; PRICE: None; SNAPEDA_LINK: https://www.snapeda.com/parts/LQH2MCN120K02L/Murata/view-part/?ref=snap
LS1 = CMT-8504-100-SMT-TR:CMT-8504-100-SMT-TR: CMT-8504-100-SMT-TR; MANUFACTURER: CUI Inc.; MAXIMUM_PACKAGE_HEIGHT: 4.00mm; PARTREV: 1.0; STANDARD: Manufacturer Recommendations
Q1 Q2 = BSS138:BSS138: Check availability; AVAILABILITY: In Stock; CHECK_PRICES: https://www.snapeda.com/parts/BSS138/Onsemi/view-part/?ref=eda; DESCRIPTION: N-Channel 50 V 220mA (Ta) 350mW (Ta) Surface Mount SOT-23-3; MF: onsemi; MP: BSS138; PACKAGE: SOT-23-3 ON Semiconductor; PRICE: None; SNAPEDA_LINK: https://www.snapeda.com/parts/BSS138/Onsemi/view-part/?ref=snap
R1 = SparkFun-Resistors:33OHM: 33Ω resistor A resistor is a passive two-terminal electrical component that implements electrical resistance as a circuit element. Resistors act to reduce current flow, and, at the same time, act to lower voltage levels within circuits. - Wikipedia; PROD_ID: RES-14883
R2 R6 R8 R14 R15 = SparkFun-Resistors:1KOHM: 1kΩ resistor A resistor is a passive two-terminal electrical component that implements electrical resistance as a circuit element. Resistors act to reduce current flow, and, at the same time, act to lower voltage levels within circuits. - Wikipedia; PROD_ID: RES-14342
R3 R4 = SparkFun-Resistors_Sai:27OHM: 27Ω resistor A resistor is a passive two-terminal electrical component that implements electrical resistance as a circuit element. Resistors act to reduce current flow, and, at the same time, act to lower voltage levels within circuits. - Wikipedia
R5 R19 = SparkFun-Resistors:RESISTOR: Generic Resistor Package
R7 R13 = SparkFun-Resistors:10KOHM: 10kΩ resistor A resistor is a passive two-terminal electrical component that implements electrical resistance as a circuit element. Resistors act to reduce current flow, and, at the same time, act to lower voltage levels within circuits. - Wikipedia; PROD_ID: RES-14241
R9 R10 = SparkFun-Resistors:5.1KOHM; PROD_ID: RES-14340
R11 = SparkFun-Resistors:2.2KOHM: 2.2kΩ resistor A resistor is a passive two-terminal electrical component that implements electrical resistance as a circuit element. Resistors act to reduce current flow, and, at the same time, act to lower voltage levels within circuits. - Wikipedia; PROD_ID: RES-14341; VALUE: 2.2K
R12 R21 R22 = SparkFun-Resistors:2.2KOHM: 2.2kΩ resistor A resistor is a passive two-terminal electrical component that implements electrical resistance as a circuit element. Resistors act to reduce current flow, and, at the same time, act to lower voltage levels within circuits. - Wikipedia; PROD_ID: RES-14341
R16 R17 = SparkFun-Resistors_Sai:100OHM: 100Ω resistor A resistor is a passive two-terminal electrical component that implements electrical resistance as a circuit element. Resistors act to reduce current flow, and, at the same time, act to lower voltage levels within circuits. - Wikipedia
R18 R20 = SparkFun-Resistors_Sai:10KOHM: 10kΩ resistor A resistor is a passive two-terminal electrical component that implements electrical resistance as a circuit element. Resistors act to reduce current flow, and, at the same time, act to lower voltage levels within circuits. - Wikipedia; PROD_ID: RES-14241
R23 R24 = SparkFun-Resistors:1MOHM: 1MΩ resistor A resistor is a passive two-terminal electrical component that implements electrical resistance as a circuit element. Resistors act to reduce current flow, and, at the same time, act to lower voltage levels within circuits. - Wikipedia; PROD_ID: RES-15185
R25 = SparkFun-Resistors:10KOHM: 10kΩ resistor A resistor is a passive two-terminal electrical component that implements electrical resistance as a circuit element. Resistors act to reduce current flow, and, at the same time, act to lower voltage levels within circuits. - Wikipedia; PROD_ID: RES-14241; VALUE: 10k
U1 = RP2350A:RP2350A; PROD_ID: IC-21276
U2 = RP2350A:APS6404L-3SQR-ZR; PROD_ID: IC-21870
U3 = ESP32-C3-MINI-1-N4:ESP32-C3-MINI-1-N4: Check availability; AVAILABILITY: In Stock; DESCRIPTION: Bluetooth, WiFi 802.11b/g/n, Bluetooth v5.0 Transceiver Module 2.412GHz ~ 2.484GHz PCB Trace Surface Mount; MF: Espressif Systems; MP: ESP32-C3-MINI-1-N4; PACKAGE: SMD-53 Espressif Systems; PRICE: None; PURCHASE-URL: https://pricing.snapeda.com/search/part/ESP32-C3-MINI-1-N4/?ref=eda
U4 = MIC5504-3.3YM5-T5:MIC5504-3.3YM5-T5: Linear Voltage Regulator IC 1 Output 300mA SOT-23-5 Check availability; AVAILABILITY: In Stock; CHECK_PRICES: https://www.snapeda.com/parts/MIC5504-3.3YM5-T5/Microchip/view-part/?ref=eda; DESCRIPTION: Linear Voltage Regulator IC Positive Fixed 1 Output 300mA SOT-23-5; MF: Microchip; MP: MIC5504-3.3YM5-T5; PACKAGE: SOT-23-5 Microchip; PRICE: None; SNAPEDA_LINK: https://www.snapeda.com/parts/MIC5504-3.3YM5-T5/Microchip/view-part/?ref=snap
U5 = BME690:BME690: Gas sensor measuring relative humidity, barometric pressure, ambient temperature and gas (VOC) Check availability; AVAILABILITY: In Stock; DESCRIPTION: Gas sensor measuring relative humidity, barometric pressure, ambient temperature and gas (VOC); MF: Bosch Sensortec; MP: BME688; PACKAGE: None; PRICE: None; PURCHASE-URL: https://pricing.snapeda.com/search/part/BME688/?ref=eda
U6 = ADM3260ARSZ:ADM3260ARSZ: Check availability; AVAILABILITY: In Stock; CHECK_PRICES: https://www.snapeda.com/parts/ADM3260ARSZ/Analog+Devices/view-part/?ref=eda; DESCRIPTION: Hot Swappable, Dual I2C Isolators with Integrated DC-to-DC Converter; MF: Analog Devices; MP: ADM3260ARSZ; PACKAGE: SSOP-20 Analog Devices; PRICE: None; PURCHASE-URL: https://www.snapeda.com/api/url_track_click_mouser/?unipart_id=474198&manufacturer=Analog Devices&part_name=ADM3260ARSZ&search_term=adm3260; SNAPEDA_LINK: https://www.snapeda.com/parts/ADM3260ARSZ/Analog+Devices/view-part/?ref=snap
U7 = ENS210-LQFM:ENS210-LQFM: Check availability; AVAILABILITY: In Stock; CHECK_PRICES: https://www.snapeda.com/parts/ENS210-LQFM/ScioSense/view-part/?ref=eda; DESCRIPTION: Digital relative humidity and temperature sensor; MF: ScioSense; MP: ENS210-LQFM; PACKAGE: NON STANDARD-5 ScioSense; PRICE: None; SNAPEDA_LINK: https://www.snapeda.com/parts/ENS210-LQFM/ScioSense/view-part/?ref=snap
U8 = SFH6325-X017T:SFH6325-X017T: High Speed Optocoupler, Dual Channel, 1 MBd, Transistor Output Check availability
U9 = AS3935-BQFT:AS3935-BQFT: Check availability; AVAILABILITY: In Stock; CHECK_PRICES: https://www.snapeda.com/parts/AS3935-BQFT/ScioSense/view-part/?ref=eda; DESCRIPTION: Lightning sensor IC with embedded distance estimation algorithm; MF: ScioSense; MP: AS3935-BQFT; PACKAGE: None; PRICE: None; SNAPEDA_LINK: https://www.snapeda.com/parts/AS3935-BQFT/ScioSense/view-part/?ref=snap
U10 = PCF8563T_F4_118:PCF8563T/F4,118: Real-time clock/calendar Check availability; AVAILABILITY: In Stock; CHECK_PRICES: https://www.snapeda.com/parts/PCF8563T/F4,118/NXP+Semiconductors/view-part/?ref=eda; DESCRIPTION: Real Time Clock (RTC) IC Clock/Calendar - I²C, 2-Wire Serial 8-SOIC (0.154, 3.90mm Width); MF: NXP USA; MP: PCF8563T/F4,118; PACKAGE: SOIC-8 NXP Semiconductors; PRICE: None; SNAPEDA_LINK: https://www.snapeda.com/parts/PCF8563T/F4,118/NXP+Semiconductors/view-part/?ref=snap
U11-U14 = OPS=S56AAF5:OPS-S56AAF5
U15 = SN74LVC1T45DBVRG4:SN74LVC1T45DBVRG4: Check availability; AVAILABILITY: In Stock; CHECK_PRICES: https://www.snapeda.com/parts/SN74LVC1T45DBVRG4/Texas+Instruments/view-part/?ref=eda; DESCRIPTION: Single-Bit Dual-Supply Bus Transceiver with Configurable Voltage-Level Shifting and 3-State Outputs 6-SOT-23 -40 to 85; MF: Texas Instruments; MP: SN74LVC1T45DBVRG4; PACKAGE: SOT-23-6 Texas Instruments; PRICE: None; SNAPEDA_LINK: https://www.snapeda.com/parts/SN74LVC1T45DBVRG4/Texas+Instruments/view-part/?ref=snap
U$1 = xunpu_tf123:TF-123-ARP9HXX
U$2 U$3 = pH-OEM:PH-OEM
XTAL1 = Q13FC1350000400:Q13FC1350000400: Check availability; AVAILABILITY: In Stock; CHECK_PRICES: https://www.snapeda.com/parts/Q13FC1350000400/EPSON/view-part/?ref=eda; DESCRIPTION: 32.768 kHz ±20ppm Crystal 12.5pF 70 kOhms 2-SMD, No Lead; MF: EPSON; MP: Q13FC1350000400; PACKAGE: None; PRICE: None; SNAPEDA_LINK: https://www.snapeda.com/parts/Q13FC1350000400/EPSON/view-part/?ref=snap
Y1 = SparkFun-Clocks:CRYSTAL-GROUNDED: Crystals w/ Ground Pin (Generic) These are passive quartz crystals, which can be used as a clock source for a microcontroller. Crystal's are usually two-terminal devices. A third terminal may be optionally connected to ground, as recommended by the manufaturer.; PROD_ID: XTAL-13518